# EAGLE design botboardpro-mini-motor (EAGLE 4.16)
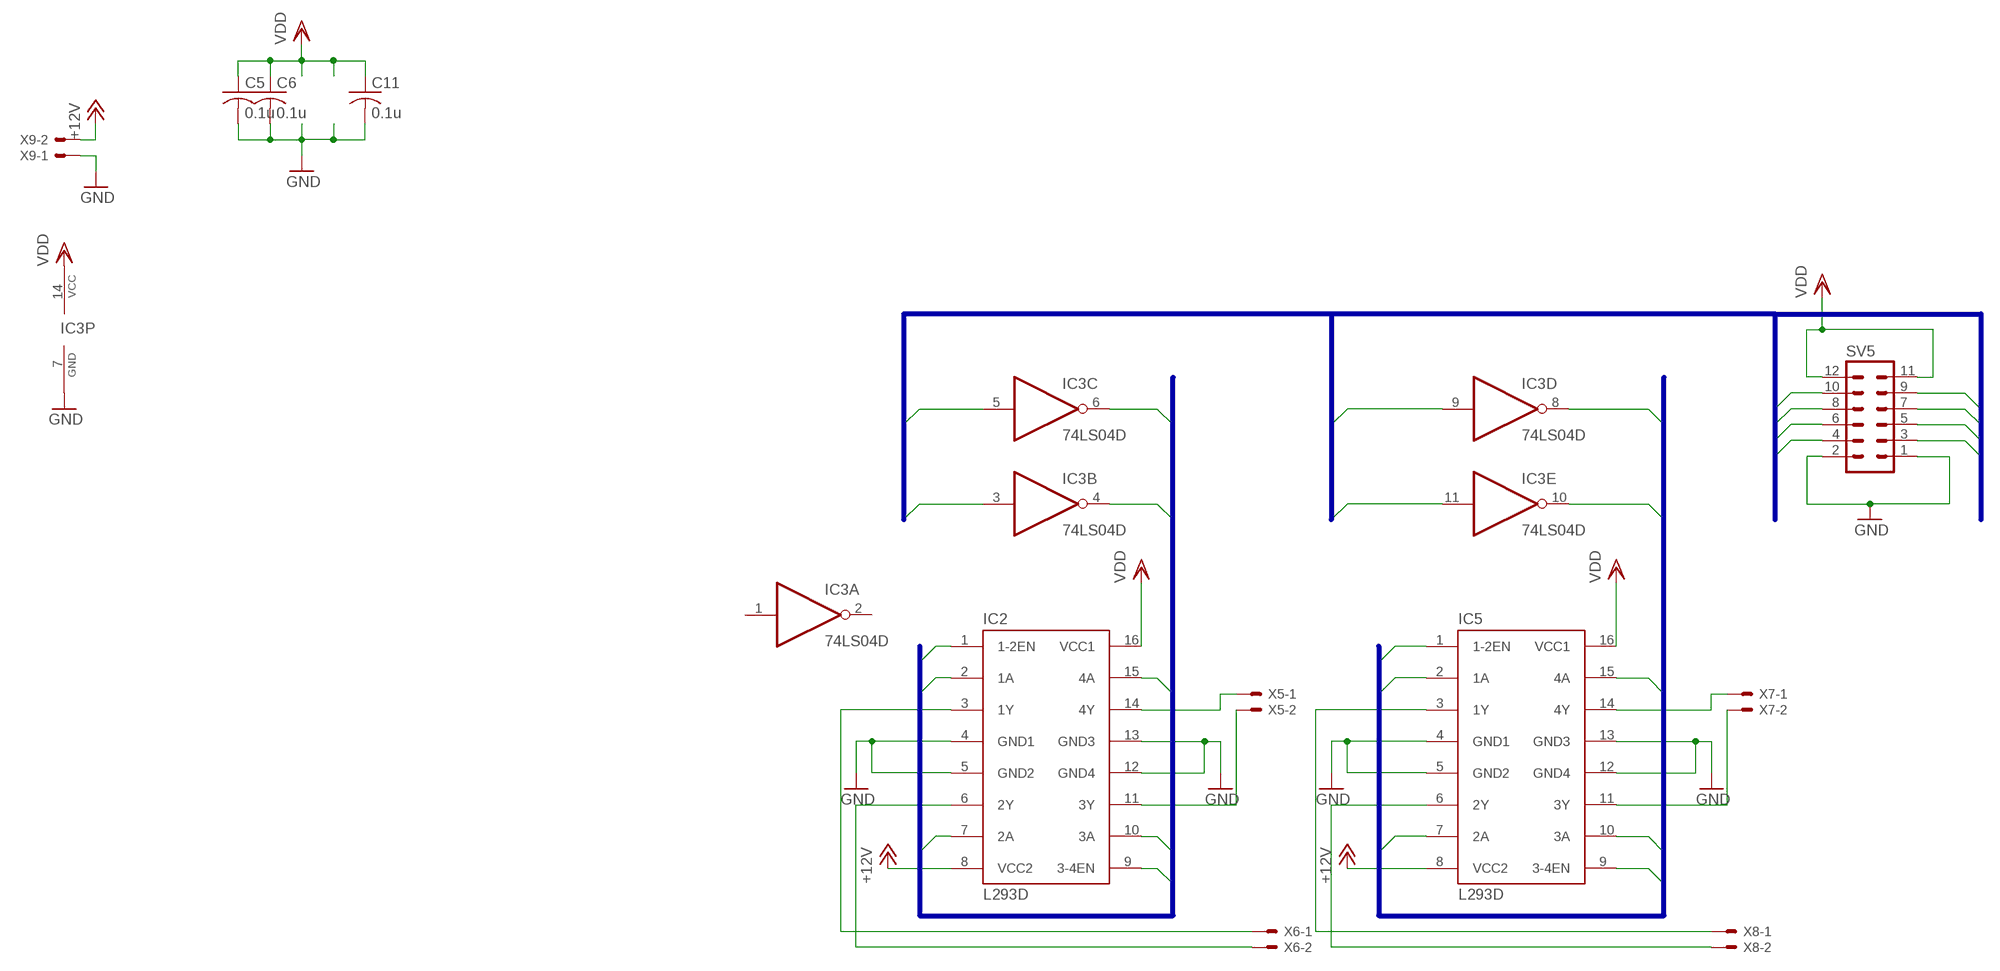
[diagram p0: schematic, sheet 1]

## Parts
C5  0.1u  C-USC0805  [C0805]
C6  0.1u  C-USC0805  [C0805]
C11  0.1u  C-USC0805  [C0805]
IC2  L293D  [DIL16]
IC3  74LS04D  [SO14]
IC5  L293D  [DIL16]
SV5  MA06-2  [MA06-2]
X5  22-23-2021  [22-23-2021]
X6  22-23-2021  [22-23-2021]
X7  22-23-2021  [22-23-2021]
X8  22-23-2021  [22-23-2021]
X9  22-23-2021  [22-23-2021]

## Nets
+12V: IC2.8(VCC2) IC5.8(VCC2) X9.2
/RB0: IC3.10(E:O) IC5.15(4A)
/RB2: IC2.7(2A) IC3.6(C:O)
/RB4: IC2.15(4A) IC3.4(B:O)
/RD6: IC3.8(D:O) IC5.7(2A)
GND: C5.2 C6.2 C11.2 IC2.4(GND1) IC2.5(GND2) IC2.12(GND4) IC2.13(GND3) IC3.7(P:GND) IC5.4(GND1) IC5.5(GND2) IC5.12(GND4) IC5.13(GND3) SV5.1 SV5.2 X9.1
N$2: IC2.14(4Y) X5.1
N$3: IC2.11(3Y) X5.2
N$4: IC2.3(1Y) X6.1
N$5: IC2.6(2Y) X6.2
N$6: IC5.14(4Y) X7.1
N$7: IC5.11(3Y) X7.2
N$8: IC5.3(1Y) X8.1
N$9: IC5.6(2Y) X8.2
RB0: IC3.11(E:I) IC5.10(3A) SV5.10
RB1: IC5.9(3-4EN) SV5.8
RB2: IC2.2(1A) IC3.5(C:I) SV5.6
RB3: IC2.1(1-2EN) SV5.4
RB4: IC2.10(3A) IC3.3(B:I) SV5.9
RB5: IC2.9(3-4EN) SV5.7
RD6: IC3.9(D:I) IC5.2(1A) SV5.5
RD7: IC5.1(1-2EN) SV5.3
VDD: C5.1 C6.1 C11.1 IC2.16(VCC1) IC3.14(P:VCC) IC5.16(VCC1) SV5.11 SV5.12
Unconnected: IC3.1(A:I) IC3.2(A:O) IC3.12(F:O) IC3.13(F:I)

## Buses
RA[0..5],RB[0..7],RC[0..7],RD[0..7],RE[0..2],MCLR
RB5,RB4,/RB4,RB3,RB2,/RB2
RB1,RB0,/RB0,RD7,RD6,/RD6

## Library data of the parts
C5 C6 C11 = rcl:C-US: CAPACITOR, American symbol
IC2 IC5 = st-microelectronics:L293D: PUSH-PULL 4 CHANNEL DRIVER
IC3 = 74xx-us:74*04: Hex INVERTER
SV5 = con-lstb:MA06-2: PIN HEADER
X5-X9 = con-molex:22-23-2021: .100" (2.54mm) Center Header - 2 Pin

## Board
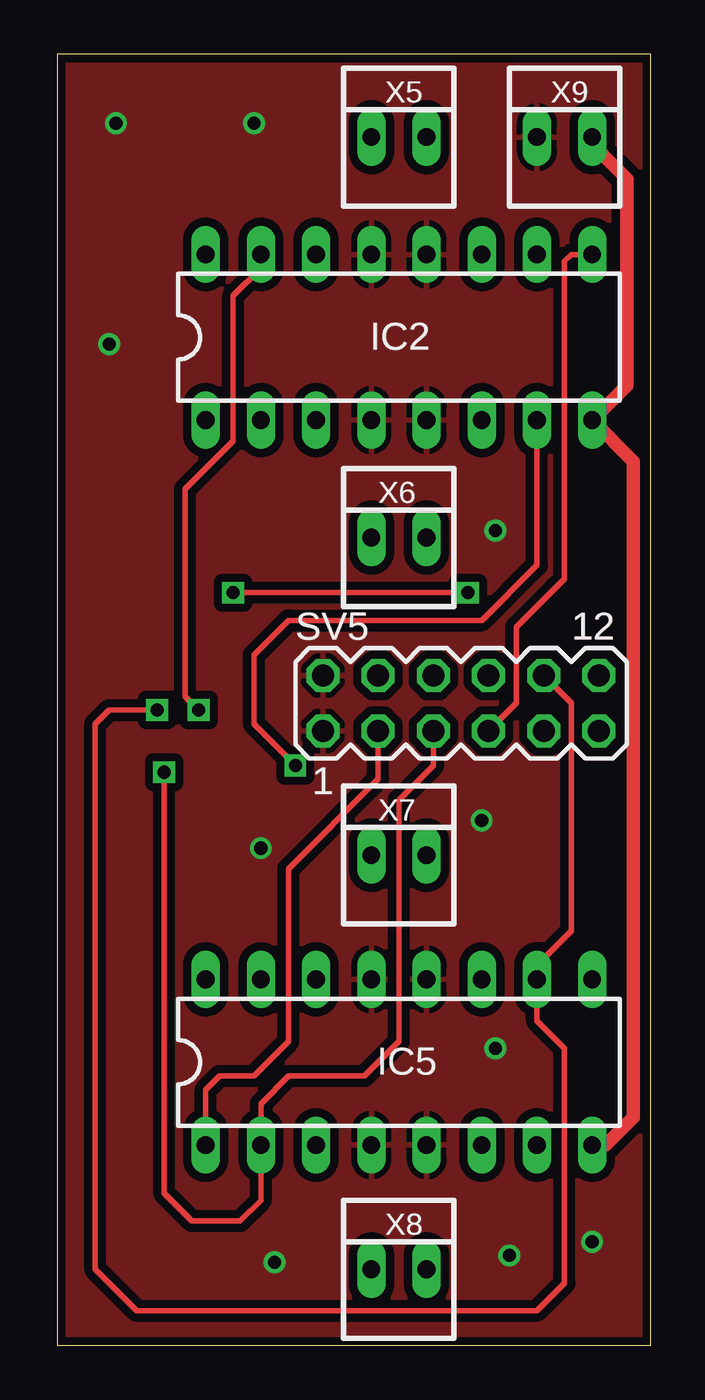
[diagram p1: board, top side]
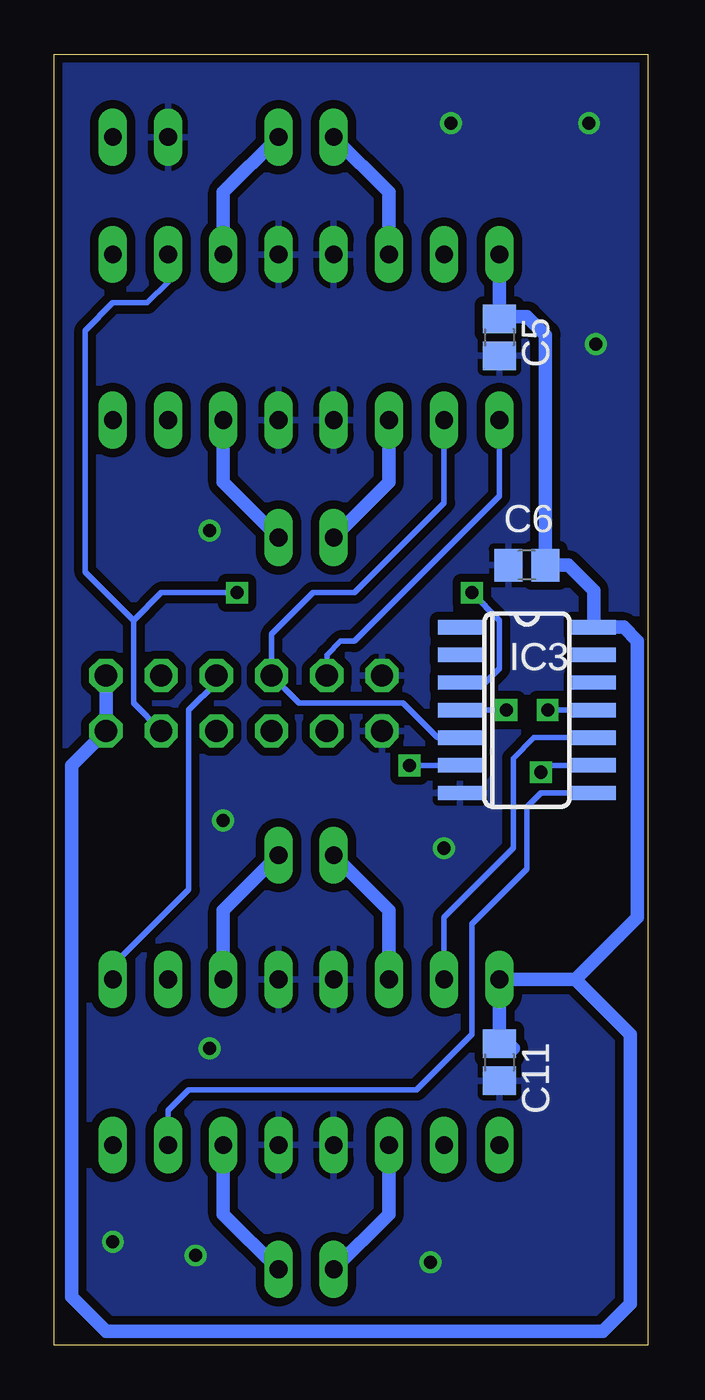
[diagram p2: board, bottom side, seen from below]

Size 27.29 x 59.36 mm. Coordinates in mm from the lower left corner, seen from the top.
Outline: 0,0 27.29,0 27.29,59.36 0,59.36 0,0
Copper layers (1*16): Top 0.035mm / dielectric 1.5mm / Bottom 0.035mm
Design rules "default": minimum track width 4mil, minimum drill 0.6mm, track to track 8mil, track to pad 8mil, pad to pad 8mil, via to via 8mil, smd to smd 8mil, copper to edge 5mil, drill to drill 8mil, minimum pad ring 10mil, minimum via ring 8mil, stop-mask expansion 4mil, vias tented up to drill 0mil, thermal gap 10mil

### Footprints (pad centres in the part's own frame; a part is rotated, then mirrored left to right if it is on the bottom)
C0805 = smd 1.3 x 1.5: 1 -0.85,0; 2 0.85,0
DIL16 = drill 0.813 long: 1 -8.89,-3.81; 2 -6.35,-3.81; 3 -3.81,-3.81; 4 -1.27,-3.81; 5 1.27,-3.81; 6 3.81,-3.81; 7 6.35,-3.81; 8 8.89,-3.81; 9 8.89,3.81; 10 6.35,3.81; 11 3.81,3.81; 12 1.27,3.81; 13 -1.27,3.81; 14 -3.81,3.81; 15 -6.35,3.81; 16 -8.89,3.81
SO14 = smd 0.66 x 2.032: 1 -3.81,-3.073; 2 -2.54,-3.073; 3 -1.27,-3.073; 4 0,-3.073; 5 1.27,-3.073; 6 2.54,-3.073; 7 3.81,-3.073; 8 3.81,3.073; 9 2.54,3.073; 10 1.27,3.073; 11 0,3.073; 12 -1.27,3.073; 13 -2.54,3.073; 14 -3.81,3.073
MA06-2 = drill 1.016 octagon: 1 -6.35,-1.27; 2 -6.35,1.27; 3 -3.81,-1.27; 4 -3.81,1.27; 5 -1.27,-1.27; 6 -1.27,1.27; 7 1.27,-1.27; 8 1.27,1.27; 9 3.81,-1.27; 10 3.81,1.27; 11 6.35,-1.27; 12 6.35,1.27
22-23-2021 = drill 0.813 long: 1 -1.27,0; 2 1.27,0

### Placement (x,y rotation side)
C5  6.82,46.35 270 bottom
C6  5.55,35.87 180 bottom
C11  6.82,13.01 270 bottom
IC2  15.71,46.35 0 top
IC3  5.55,29.2 270 bottom
IC5  15.71,13.01 0 top
SV5  18.57,29.52 0 top
X5  15.71,55.56 0 top
X6  15.71,37.14 0 top
X7  15.71,22.54 0 top
X8  15.71,3.49 0 top
X9  23.33,55.56 0 top

### Tracks (layer width: path | path; a pad name or v marks a point on that pad's centre or on a via)
+12V
  Top 0.61: X9.2 24.6,55.24 26.19,53.65 26.19,44.13 IC2.8 26.51,40.63 26.51,10.47 25.23,9.2 IC5.8
/RB0
  Bottom 0.254: IC3.10 5.23,27.94 6.18,26.98 6.18,22.85 9.36,19.68 IC5.15
/RB2  (via drill 0.6)
  Top 0.254: IC2.7 22.06,35.87 19.52,33.33 10.63,33.33 9.04,31.74 9.04,28.57 v10.95,26.66
  Bottom 0.254: 8.41,26.66 IC3.6 v10.95,26.66
/RB4  (via drill 0.6)
  Top 0.254: IC2.15 9.36,49.52 8.09,48.25 8.09,41.59 5.87,39.36 5.87,29.84 v6.5,29.2
  Bottom 0.254: 8.73,29.2 IC3.4 v6.5,29.2
/RD6
  Bottom 0.254: IC3.8 4.91,25.4 5.55,24.76 5.55,21.9 8.09,19.36 8.09,14.28 10.63,11.74 21.11,11.74 22.06,10.79 IC5.7
GND  (via drill 0.6)
  other vias: 2.69,56.19 9.04,56.19 2.37,46.03 9.36,22.85 9.99,3.8 20.79,4.12 24.6,4.76 20.16,13.65 19.52,24.12 20.16,37.46
  pour Bottom (isolate 0.381): -0.8,59.37 -0.8,-0.96 27.46,-0.96 27.46,59.37
  pour Top (isolate 0.381): -0.48,59.05 27.14,59.05 27.14,-0.64 -0.48,-0.64
N$2
  Bottom 0.61: IC2.14 11.9,53.02 X5.1
N$3
  Bottom 0.61: IC2.11 19.52,53.02 X5.2
N$4
  Bottom 0.61: IC2.3 11.9,39.68 X6.1
N$5
  Bottom 0.61: IC2.6 19.52,39.68 X6.2
N$6
  Bottom 0.61: IC5.14 11.9,20 X7.1
N$7
  Bottom 0.61: IC5.11 19.52,20 X7.2
N$8
  Bottom 0.61: IC5.3 11.9,6.03 X8.1
N$9
  Bottom 0.61: IC5.6 19.52,6.03 X8.2
RB0  (via drill 0.6)
  Top 0.254: SV5.10 23.65,29.52 23.65,19.05 22.06,17.46 IC5.10 22.06,14.92 23.33,13.65 23.33,2.85 22.06,1.58 3.65,1.58 1.74,3.49 1.74,28.57 2.37,29.2 v4.6,29.2
  Bottom 0.254: v4.6,29.2 IC3.11
RB1
  Bottom 0.254: SV5.8 19.84,30.48 21.11,29.2 21.11,20.95 24.6,17.46 IC5.9
RB2
  Bottom 0.254: IC2.2 9.36,38.73 13.49,34.6 15.39,34.6 17.3,32.7 SV5.6 16.03,29.52 11.26,29.52 9.68,27.94 IC3.5
RB3
  Bottom 0.254: IC2.1 6.82,39.05 13.49,32.38 14.12,32.38 14.76,31.74 SV5.4
RB4  (via drill 0.6)
  Top 0.254: v8.09,34.6 v18.89,34.6
  Bottom 0.254: SV5.9 23.65,29.52 23.65,33.33 | 23.65,33.33 25.87,35.55 25.87,46.67 24.6,47.94 23.01,47.94 22.06,48.89 IC2.10 | IC3.3 7.46,30.48 6.82,31.11 6.82,33.33 v8.09,34.6 | v18.89,34.6 22.38,34.6 23.65,33.33
RB5
  Top 0.254: IC2.9 23.65,50.16 23.33,49.84 23.33,35.24 21.11,33.02 21.11,29.52 SV5.7
RD6  (via drill 0.6)
  Top 0.254: SV5.5 17.3,26.66 15.71,25.08 15.71,13.97 14.12,12.38 10.63,12.38 9.36,11.11 IC5.2 9.36,6.66 8.41,5.71 6.18,5.71 4.91,6.98 v4.91,26.35
  Bottom 0.254: IC3.9 4.6,26.66 v4.91,26.35
RD7
  Top 0.254: SV5.3 14.76,26.03 10.63,21.9 10.63,13.97 9.04,12.38 7.46,12.38 6.82,11.74 IC5.1
VDD
  Bottom 0.61: 6.82,13.97 IC5.16 3.33,16.82 | 25.23,30.79 SV5.12 SV5.11 26.51,26.66 26.51,2.22 24.92,0.63 2.06,0.63 0.79,1.9 0.79,14.28 3.33,16.82 | 7.14,50.16 IC2.16 C5.1 6.82,46.98 6.5,47.3 5.55,47.3 4.7,46.45 C6.1 3.65,35.87 2.48,34.7 IC3.14 1.11,33.02 0.47,32.38 0.47,19.68 3.33,16.82 | 6.82,13.97 C11.1 | 6.18,13.65 6.5,13.65 6.82,13.97

### Text on the board
_tsilk: X5 | X9 | IC2 | X6 | SV5 | 12 | 1 | X7 | IC5 | X8
_bsilk: C5 | C6 | IC3 | C11